# Altium project PCBGame.PrjPcb
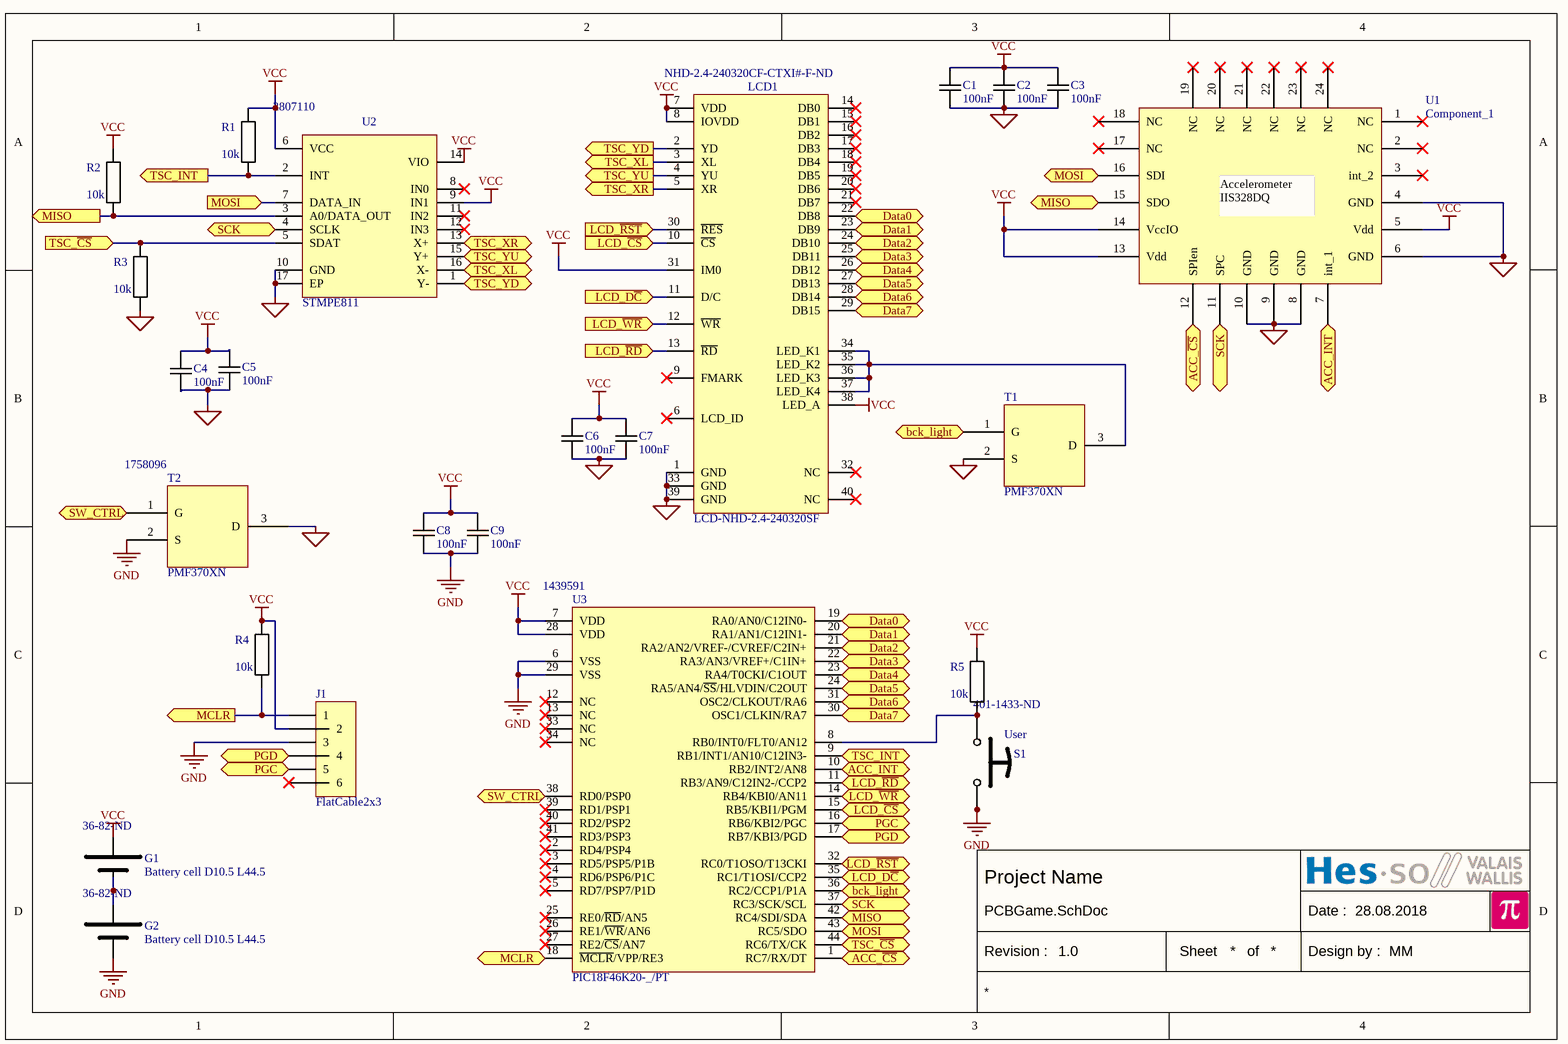
[diagram p0: PCBGame.SchDoc]
PcbDate: 28.08.2018; PcbDesigner: MM; PcbRevision: 1.0; SchematicDate: 28.08.2018; SchematicDesigner: MM; SchematicRevision: 1.0
1 sheet, 24 parts. Net scope: global (net labels, ports and power ports of the same name join across sheets).
Board file: PCBGame.PcbDoc

## Sheet PCBGame.SchDoc
size A4; CompanyName: HESSO; Address1: Route du Rawyl 47; Address2: 1950 Sion; Address3: Switzerland; PageSetup: Record=PageOptions|CenterHorizontal=True|CenterVertical=True|PrintScale=1.00|XCorrection=1.00|YCorrection=1.00|PrintKind=1|BorderSize=5000000|LeftOffset=0|BottomOffset=0|Orientation=2|PaperLength=1000|PaperWidth=1000|Scale=100|PaperSource=15|PrintQuality=1200|MediaType=1|DitherType=10|PrintScaleMode=1|PaperKind=A4|PaperIndex=9; ProjectName: Project Name

### Parts
C1  100nF  [CAPACITOR 2012 REFLOW]
C2  100nF  [CAPACITOR 2012 REFLOW]
C3  100nF  [CAPACITOR 2012 REFLOW]
C4  100nF  [CAPACITOR 2012 REFLOW]
C5  100nF  [CAPACITOR 2012 REFLOW]
C6  100nF  [CAPACITOR 2012 REFLOW]
C7  100nF  [CAPACITOR 2012 REFLOW]
C8  100nF  [CAPACITOR 2012 REFLOW]
C9  100nF  [CAPACITOR 2012 REFLOW]
G1  Battery cell D10.5 L44.5  Supplier Part Number 1: 36-82-ND  [1.5V Cell AAA/LR03]
G2  Battery cell D10.5 L44.5  Supplier Part Number 1: 36-82-ND  [1.5V Cell AAA/LR03]
J1  FlatCable2x3  [FlatCable2x3 2MM Straight TH FCI 98414-G06-06ULF]
LCD1  LCD-NHD-2.4-240320SF  Supplier Part Number 1: NHD-2.4-240320CF-CTXI#-F-ND  [LCD-NHD-2.4-240320SF]
R1  10k  [RESISTOR 2012 REFLOW]
R2  10k  [RESISTOR 2012 REFLOW]
R3  10k  [RESISTOR 2012 REFLOW]
R4  10k  [RESISTOR 2012 REFLOW]
R5  10k  [RESISTOR 2012 REFLOW]
S1  User  Supplier Part Number 1: 401-1433-ND  [Push Button C6.0x6.0 WE 430186130716]
T1  PMF370XN  [SOT65P210X110-3N]
T2  PMF370XN  Supplier Part Number 1: 1758096  [SOT65P210X110-3N]
U1  Component_1  [accelerometer]
U2  Supplier Part Number 1: 2807110  [QFN16 P0.5 T1.5x1.5 C3.0x3.0 H1.0]  (hidden comment: STMPE811)
U3  PIC18F46K20-_/PT  Supplier Part Number 1: 1439591  [TQFP44 P0.8 C10X10 H1.2]

### Ports
ACC_INT (in), ACC_INT (out), ACC_~{CS} (in), ACC_~{CS} (out), bck_light (in), bck_light (out), Data0 (bidir), Data1 (bidir), Data2 (bidir), Data3 (bidir), Data4 (bidir), Data5 (bidir), Data6 (bidir), Data7 (bidir), LCD_D~{C} (in), LCD_D~{C} (out), LCD_~{CS} (in), LCD_~{CS} (out), LCD_~{RD} (in), LCD_~{RD} (out), LCD_~{RST} (in), LCD_~{RST} (out), LCD_~{WR} (in), LCD_~{WR} (out), MCLR (in), MCLR (out), MISO (in), MISO (out), MOSI (in), MOSI (out), PGC (in), PGC (out), PGD (in), PGD (out), SCK (in), SCK (out), SW_CTRL (in), SW_CTRL (out), TSC_INT (in), TSC_INT (out), TSC_XL (in), TSC_XL (out), TSC_XR (in), TSC_XR (out), TSC_YD (in), TSC_YD (out), TSC_YU (in), TSC_YU (out), TSC_~{CS} (in), TSC_~{CS} (out)

### Nets
CTRL_GND: C1.1 C2.1 C3.1 C4.1 C5.1 C6.1 C7.1 LCD1.1(GND) LCD1.33(GND) LCD1.39(GND) R3.1 T1.2(S) T2.3(D) U1.4(GND) U1.6(GND) U1.8(GND) U1.9(GND) U1.10(GND) U2.10(GND) U2.17(EP)
GND: C8.1 C9.1 G2.2(—) J1.3 S1.3 S1.4 T2.2(S) U3.6(VSS) U3.29(VSS)
VCC: C1.2 C2.2 C3.2 C4.2 C5.2 C6.2 C7.2 C8.2 C9.2 G1.1(+) J1.2 LCD1.7(VDD) LCD1.8(IOVDD) LCD1.31(IM0) LCD1.38(LED_A) R1.2 R2.2 R4.2 R5.2 U1.5(Vdd) U1.13(Vdd) U1.14(VccIO) U2.6(VCC) U2.9(IN1) U2.14(VIO) U3.7(VDD) U3.28(VDD)
NetG1_2: G1.2(—) G2.1(+)
NetJ1_1: J1.1 R4.1 U3.18(~{MCLR}/VPP/RE3) ; port MCLR
NetJ1_4: J1.4 U3.17(RB7/KBI3/PGD) ; port PGD
NetJ1_5: J1.5 U3.16(RB6/KBI2/PGC) ; port PGC
NetLCD1_2: LCD1.2(YD) U2.1(Y-) ; port TSC_YD
NetLCD1_3: LCD1.3(XL) U2.16(X-) ; port TSC_XL
NetLCD1_4: LCD1.4(YU) U2.15(Y+) ; port TSC_YU
NetLCD1_5: LCD1.5(XR) U2.13(X+) ; port TSC_XR
NetLCD1_10: LCD1.10(~{CS}) U3.15(RB5/KBI1/PGM) ; port LCD_~{CS}
NetLCD1_11: LCD1.11(D/C) U3.35(RC1/T1OSI/CCP2) ; port LCD_D~{C}
NetLCD1_12: LCD1.12(~{WR}) U3.14(RB4/KBI0/AN11) ; port LCD_~{WR}
NetLCD1_13: LCD1.13(~{RD}) U3.11(RB3/AN9/C12IN2-/CCP2) ; port LCD_~{RD}
NetLCD1_22: LCD1.22(DB8) U3.19(RA0/AN0/C12IN0-) ; port Data0
NetLCD1_23: LCD1.23(DB9) U3.20(RA1/AN1/C12IN1-) ; port Data1
NetLCD1_24: LCD1.24(DB10) U3.21(RA2/AN2/VREF-/CVREF/C2IN+) ; port Data2
NetLCD1_25: LCD1.25(DB11) U3.22(RA3/AN3/VREF+/C1IN+) ; port Data3
NetLCD1_26: LCD1.26(DB12) U3.23(RA4/T0CKI/C1OUT) ; port Data4
NetLCD1_27: LCD1.27(DB13) U3.24(RA5/AN4/~{SS}/HLVDIN/C2OUT) ; port Data5
NetLCD1_28: LCD1.28(DB14) U3.31(OSC2/CLKOUT/RA6) ; port Data6
NetLCD1_29: LCD1.29(DB15) U3.30(OSC1/CLKIN/RA7) ; port Data7
NetLCD1_30: LCD1.30(~{RES}) U3.32(RC0/T1OSO/T13CKI) ; port LCD_~{RST}
NetLCD1_34: LCD1.34(LED_K1) LCD1.35(LED_K2) LCD1.36(LED_K3) LCD1.37(LED_K4) T1.3(D)
NetR1_1: R1.1 U2.2(INT) U3.9(RB1/INT1/AN10/C12IN3-) ; port TSC_INT
NetR2_1: R2.1 U1.15(SDO) U2.3(A0/DATA_OUT) U3.42(RC4/SDI/SDA) ; port MISO
NetR3_2: R3.2 U2.5(SDAT) U3.44(RC6/TX/CK) ; port TSC_~{CS}
NetR5_1: R5.1 S1.1 S1.2 U3.8(RB0/INT0/FLT0/AN12)
NetT1_1: T1.1(G) U3.36(RC2/CCP1/P1A) ; port bck_light
NetT2_1: T2.1(G) U3.38(RD0/PSP0) ; port SW_CTRL
NetU1_7: U1.7(int_1) U3.10(RB2/INT2/AN8) ; port ACC_INT
NetU1_11: U1.11(SPC) U2.4(SCLK) U3.37(RC3/SCK/SCL) ; port SCK
NetU1_12: U1.12(SPIen) U3.1(RC7/RX/DT) ; port ACC_~{CS}
NetU1_16: U1.16(SDI) U2.7(DATA_IN) U3.43(RC5/SDO) ; port MOSI

Not connected (* = marked no-connect by the designer): J1 6*; LCD1 6(LCD_ID)* 9(FMARK)* 14(DB0)* 15(DB1)* 16(DB2)* 17(DB3)* 18(DB4)* 19(DB5)* 20(DB6)* 21(DB7)* 32(NC)* 40(NC)*; U1 1(NC)* 2(NC)* 3(int_2)* 17(NC)* 18(NC)* 19(NC)* 20(NC)* 21(NC)* 22(NC)* 23(NC)* 24(NC)*; U2 8(IN0)* 11(IN2)* 12(IN3)*; U3 2(RD4/PSP4)* 3(RD5/PSP5/P1B)* 4(RD6/PSP6/P1C)* 5(RD7/PSP7/P1D)* 12(NC)* 13(NC)* 25(RE0/~{RD}/AN5)* 26(RE1/~{WR}/AN6)* 27(RE2/~{CS}/AN7)* 33(NC)* 34(NC)* 39(RD1/PSP1)* 40(RD2/PSP2)* 41(RD3/PSP3)*

### Notes on the sheet
- Date :
- Revision :
- Sheet
- of
- Design by :
- (in symbol Component_1) Accelerometer / IIS328DQ /

### Library data of the parts
C1-C9 = Capacitor: Value: 100nF
G1 G2 = Battery: Battery Generic; Value: Battery cell D10.5 L44.5; Supplier 1: Digi-Key
LCD1 = LCD-NHD-2.4-240320SF: NEWHEAVEN LCD; Value: LCD-NHD-2.4-240320SF; Supplier 1: Digi-Key
R1-R5 = Resistor: Value: 10k
S1 = Push Button 4Pins: Push Button, 4 pins, 2 poles parrallèle; pin to pad: 2>3 3>2; Value: User; Supplier 1: Digi-Key
T1 T2 = Component_2: Value: PMF370XN
  T2: Supplier 1: Farnell
U2 = STMPE811Q: Advanced resistive touch screen controller  with 8-bit GPIO expander; Value: STMPE811; Supplier 1: Farnell
U3 = PIC18F46K20-_/PT: Flash Microcontrollers  with 10-Bit A/D and nanoWatt Technology; Value: PIC18F46K20-_/PT; Supplier 1: Farnell